# Altium schematic sheet Public Power Supply (CPU & MISC).schdoc
size 510 x 332 mm
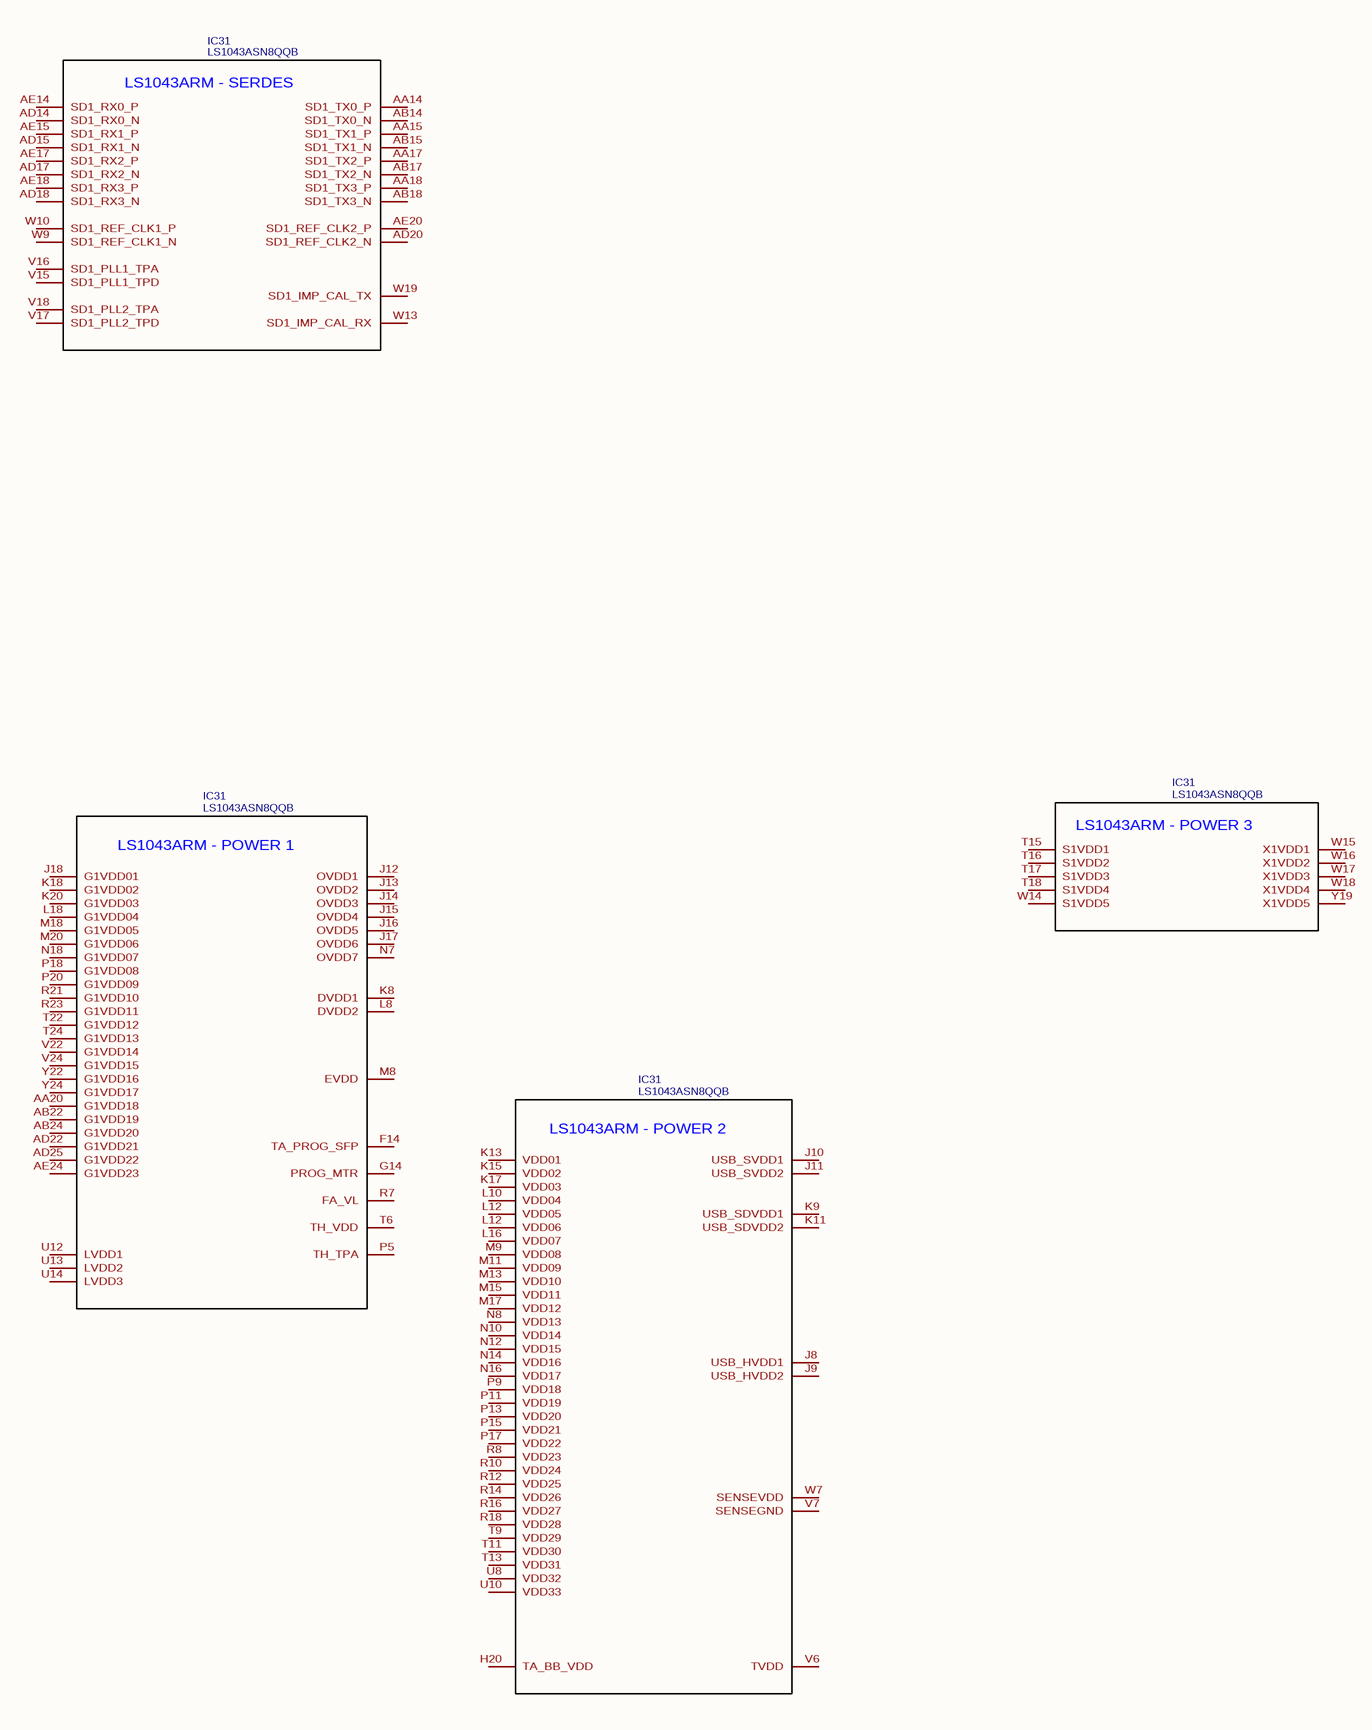
[diagram p0: Public Power Supply (CPU & MISC).schdoc, left]
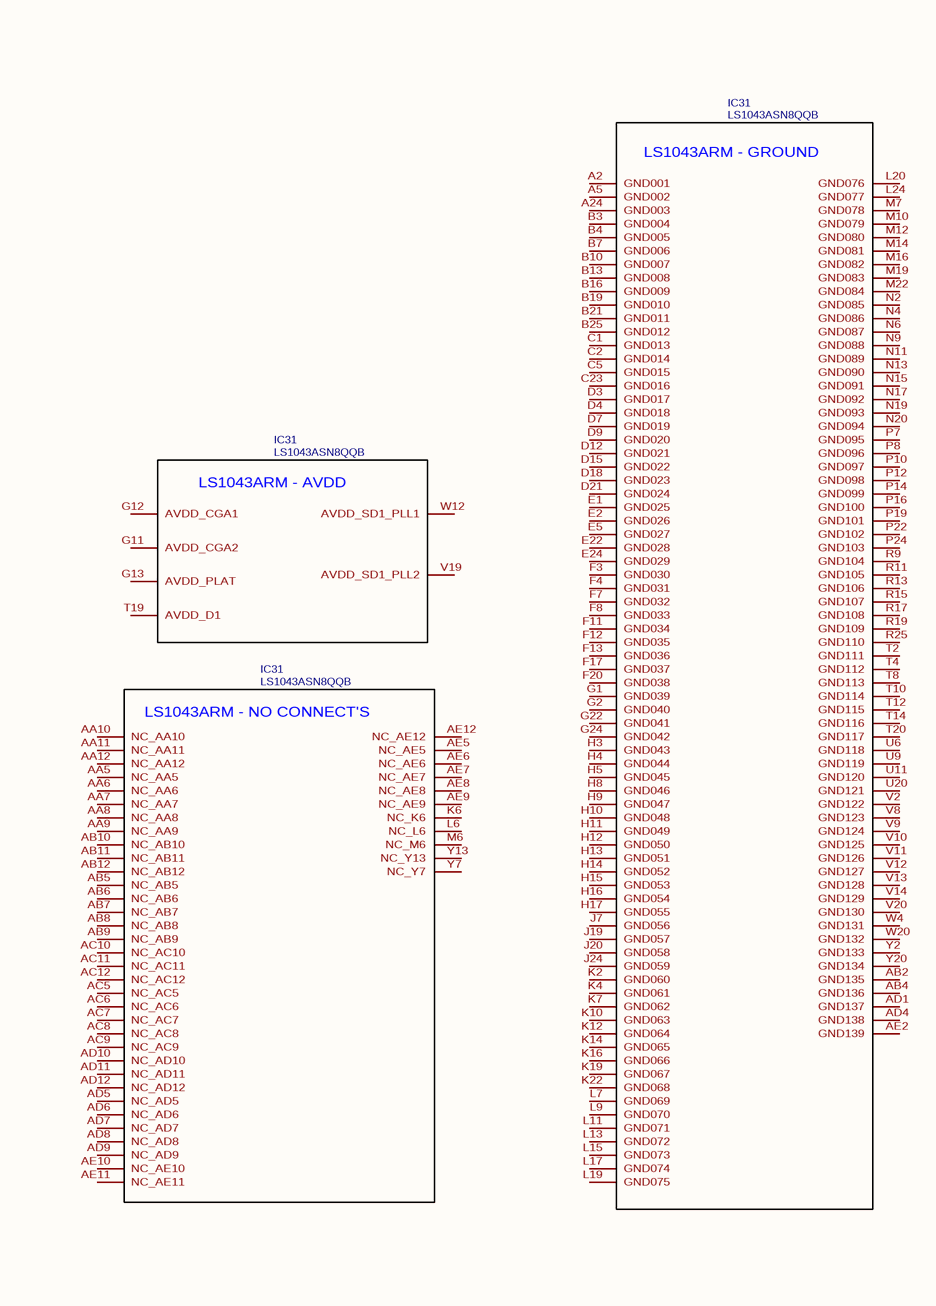
[diagram p1: Public Power Supply (CPU & MISC).schdoc, right]

## Parts
(Parts that share a designator on the sheet are numbered #1, #2 ... from top to bottom, then left to right.)
IC31#1  LS1043ASN8QQB  [BGA621C65P25X25_1700X1700X218N]
IC31#2  LS1043ASN8QQB  [BGA621C65P25X25_1700X1700X218N]
IC31#3  LS1043ASN8QQB  [BGA621C65P25X25_1700X1700X218N]
IC31#4  LS1043ASN8QQB  [BGA621C65P25X25_1700X1700X218N]
IC31#5  LS1043ASN8QQB  [BGA621C65P25X25_1700X1700X218N]
IC31#6  LS1043ASN8QQB  [BGA621C65P25X25_1700X1700X218N]
IC31#7  LS1043ASN8QQB  [BGA621C65P25X25_1700X1700X218N]

## Nets

Not connected (* = marked no-connect by the designer): IC31#1 AA14(SD1_TX0_P) AA15(SD1_TX1_P) AA17(SD1_TX2_P) AA18(SD1_TX3_P) AB14(SD1_TX0_N) AB15(SD1_TX1_N) AB17(SD1_TX2_N) AB18(SD1_TX3_N) AD14(SD1_RX0_N) AD15(SD1_RX1_N) AD17(SD1_RX2_N) AD18(SD1_RX3_N) AD20(SD1_REF_CLK2_N) AE14(SD1_RX0_P) AE15(SD1_RX1_P) AE17(SD1_RX2_P) AE18(SD1_RX3_P) AE20(SD1_REF_CLK2_P) V15(SD1_PLL1_TPD) V16(SD1_PLL1_TPA) V17(SD1_PLL2_TPD) V18(SD1_PLL2_TPA) W9(SD1_REF_CLK1_N) W10(SD1_REF_CLK1_P) W13(SD1_IMP_CAL_RX) W19(SD1_IMP_CAL_TX); IC31#2 G11(AVDD_CGA2) G12(AVDD_CGA1) G13(AVDD_PLAT) T19(AVDD_D1) V19(AVDD_SD1_PLL2) W12(AVDD_SD1_PLL1); IC31#3 T15(S1VDD1) T16(S1VDD2) T17(S1VDD3) T18(S1VDD4) W14(S1VDD5) W15(X1VDD1) W16(X1VDD2) W17(X1VDD3) W18(X1VDD4) Y19(X1VDD5); IC31#4 AA5(NC_AA5) AA6(NC_AA6) AA7(NC_AA7) AA8(NC_AA8) AA9(NC_AA9) AA10(NC_AA10) AA11(NC_AA11) AA12(NC_AA12) AB5(NC_AB5) AB6(NC_AB6) AB7(NC_AB7) AB8(NC_AB8) AB9(NC_AB9) AB10(NC_AB10) AB11(NC_AB11) AB12(NC_AB12) AC5(NC_AC5) AC6(NC_AC6) AC7(NC_AC7) AC8(NC_AC8) AC9(NC_AC9) AC10(NC_AC10) AC11(NC_AC11) AC12(NC_AC12) AD5(NC_AD5) AD6(NC_AD6) AD7(NC_AD7) AD8(NC_AD8) AD9(NC_AD9) AD10(NC_AD10) AD11(NC_AD11) AD12(NC_AD12) AE5(NC_AE5) AE6(NC_AE6) AE7(NC_AE7) AE8(NC_AE8) AE9(NC_AE9) AE10(NC_AE10) AE11(NC_AE11) AE12(NC_AE12) K6(NC_K6) L6(NC_L6) M6(NC_M6) Y7(NC_Y7) Y13(NC_Y13); IC31#5 A2(GND001) A5(GND002) A24(GND003) AB2(GND135) AB4(GND136) AD1(GND137) AD4(GND138) AE2(GND139) B3(GND004) B4(GND005) B7(GND006) B10(GND007) B13(GND008) B16(GND009) B19(GND010) B21(GND011) B25(GND012) C1(GND013) C2(GND014) C5(GND015) C23(GND016) D3(GND017) D4(GND018) D7(GND019) D9(GND020) D12(GND021) D15(GND022) D18(GND023) D21(GND024) E1(GND025) E2(GND026) E5(GND027) E22(GND028) E24(GND029) F3(GND030) F4(GND031) F7(GND032) F8(GND033) F11(GND034) F12(GND035) F13(GND036) F17(GND037) F20(GND038) G1(GND039) G2(GND040) G22(GND041) G24(GND042) H3(GND043) H4(GND044) H5(GND045) H8(GND046) H9(GND047) H10(GND048) H11(GND049) H12(GND050) H13(GND051) H14(GND052) H15(GND053) H16(GND054) H17(GND055) J7(GND056) J19(GND057) J20(GND058) J24(GND059) K2(GND060) K4(GND061) K7(GND062) K10(GND063) K12(GND064) K14(GND065) K16(GND066) K19(GND067) K22(GND068) L7(GND069) L9(GND070) L11(GND071) L13(GND072) L15(GND073) L17(GND074) L19(GND075) L20(GND076) L24(GND077) M7(GND078) M10(GND079) M12(GND080) M14(GND081) M16(GND082) M19(GND083) M22(GND084) N2(GND085) N4(GND086) N6(GND087) N9(GND088) N11(GND089) N13(GND090) N15(GND091) N17(GND092) N19(GND093) N20(GND094) P7(GND095) P8(GND096) P10(GND097) P12(GND098) P14(GND099) P16(GND100) P19(GND101) P22(GND102) P24(GND103) R9(GND104) R11(GND105) R13(GND106) R15(GND107) R17(GND108) R19(GND109) R25(GND110) T2(GND111) T4(GND112) T8(GND113) T10(GND114) T12(GND115) T14(GND116) T20(GND117) U6(GND118) U9(GND119) U11(GND120) U20(GND121) V2(GND122) V8(GND123) V9(GND124) V10(GND125) V11(GND126) V12(GND127) V13(GND128) V14(GND129) V20(GND130) W4(GND131) W20(GND132) Y2(GND133) Y20(GND134); IC31#6 AA20(G1VDD18) AB22(G1VDD19) AB24(G1VDD20) AD22(G1VDD21) AD25(G1VDD22) AE24(G1VDD23) F14(TA_PROG_SFP) G14(PROG_MTR) J12(OVDD1) J13(OVDD2) J14(OVDD3) J15(OVDD4) J16(OVDD5) J17(OVDD6) J18(G1VDD01) K8(DVDD1) K18(G1VDD02) K20(G1VDD03) L8(DVDD2) L18(G1VDD04) M8(EVDD) M18(G1VDD05) M20(G1VDD06) N7(OVDD7) N18(G1VDD07) P5(TH_TPA) P18(G1VDD08) P20(G1VDD09) R7(FA_VL) R21(G1VDD10) R23(G1VDD11) T6(TH_VDD) T22(G1VDD12) T24(G1VDD13) U12(LVDD1) U13(LVDD2) U14(LVDD3) V22(G1VDD14) V24(G1VDD15) Y22(G1VDD16) Y24(G1VDD17); IC31#7 H20(TA_BB_VDD) J8(USB_HVDD1) J9(USB_HVDD2) J10(USB_SVDD1) J11(USB_SVDD2) K9(USB_SDVDD1) K11(USB_SDVDD2) K13(VDD01) K15(VDD02) K17(VDD03) L10(VDD04) L12(VDD05) L16(VDD07) M9(VDD08) M11(VDD09) M13(VDD10) M15(VDD11) M17(VDD12) N8(VDD13) N10(VDD14) N12(VDD15) N14(VDD16) N16(VDD17) P9(VDD18) P11(VDD19) P13(VDD20) P15(VDD21) P17(VDD22) R8(VDD23) R10(VDD24) R12(VDD25) R14(VDD26) R16(VDD27) R18(VDD28) T9(VDD29) T11(VDD30) T13(VDD31) U8(VDD32) U10(VDD33) V6(TVDD) V7(SENSEGND) W7(SENSEVDD)

## Notes on the sheet
- (in symbol LS1043ASN8QQB) LS1043ARM - SERDES; LS1043ARM - POWER 1; LS1043ARM - POWER 2; LS1043ARM - GROUND; LS1043ARM - AVDD; LS1043ARM - NO CONNECT'S; LS1043ARM - POWER 3

## Library data of the parts
IC31#1-IC31#7 = LS1043ASN8QQB: subpart_no: 1; Contributor: Ke'Ondrae_Mell; spicePre: I; spiceSymbolName: LS1043ASN8QQB